# EasyEDA Pro project 偏置放大.eprj

# Schematic Schematic1
Board Name: Board1; Create Date: 2025-06-29; Page Name: P1; Project Name: 偏置放大; Schematic Name: Schematic1; Update Date: 2025-07-05; Page Size: A4; Version: V1.0
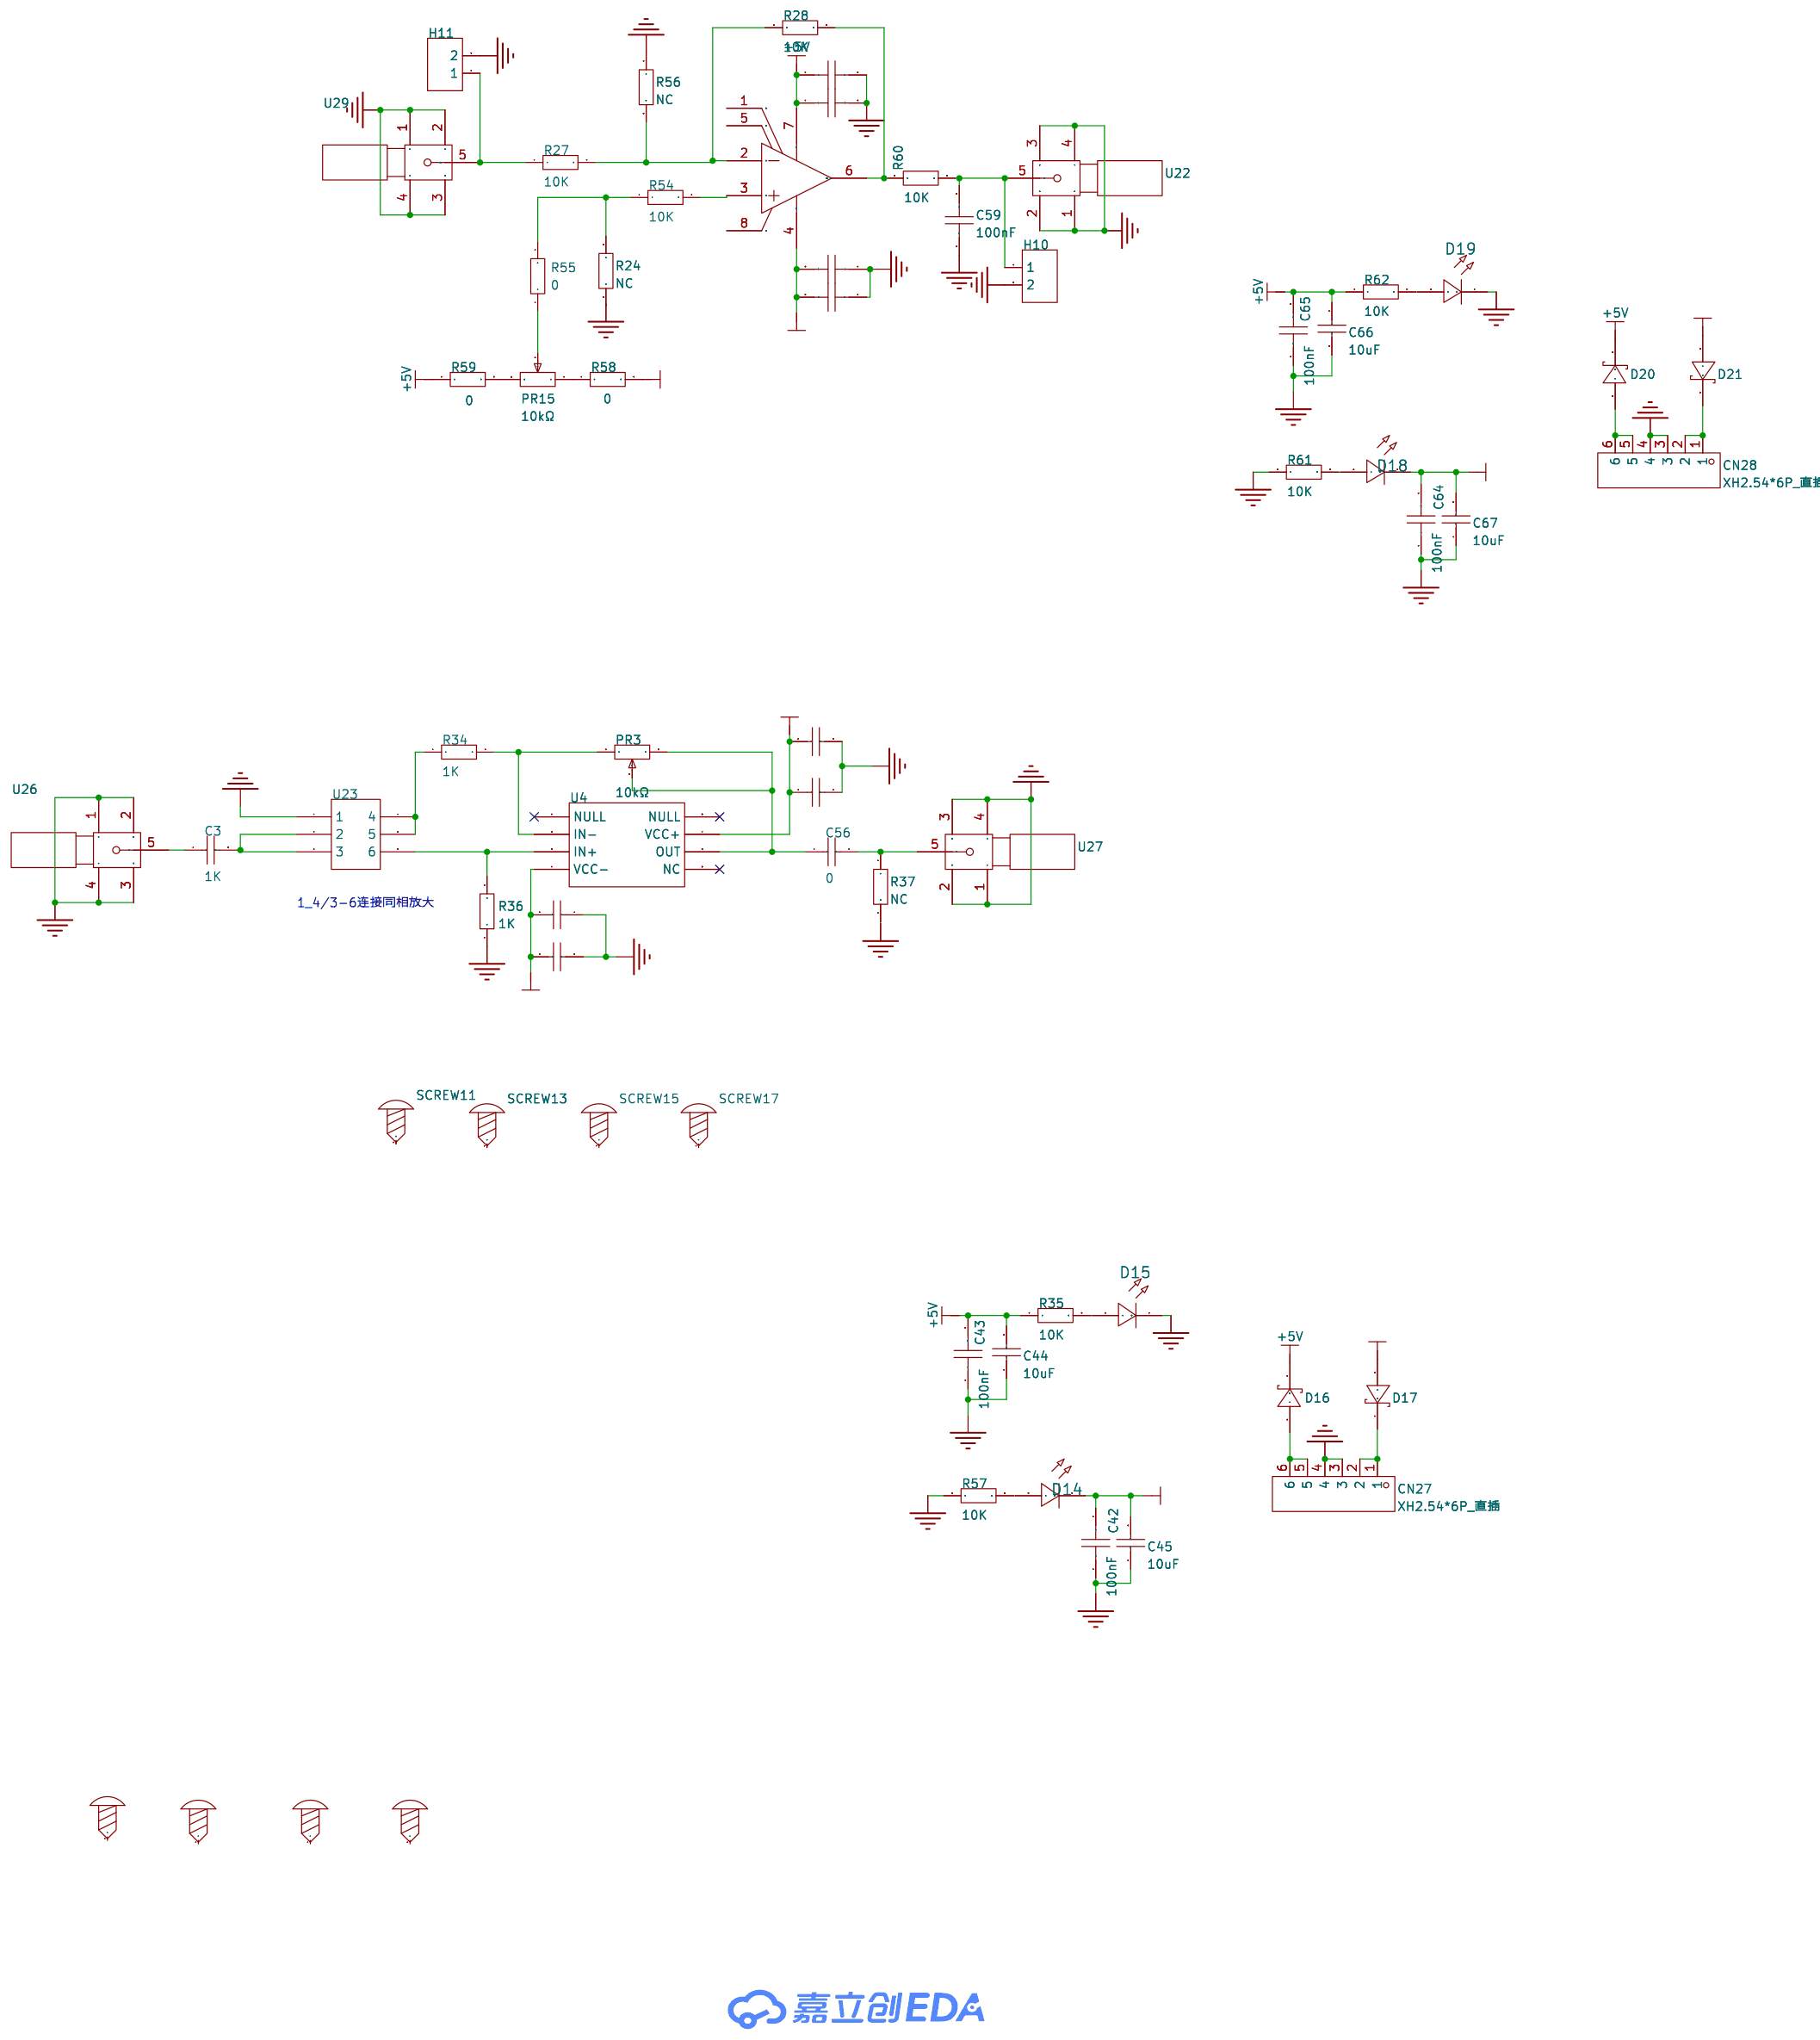
[diagram p0: schematic sheet]

## Parts
C3  1K  [R0805]
C42  100nF  [R0805]
C43  100nF  [R0805]
C44  10uF  [C1210]
C45  10uF  [C1210]
C54  104  [R0805]
C55  104  [R0805]
C56  0  [R0805]
C57  104  [R0805]
C58  104  [R0805]
C59  100nF  [R0805]
C60  100nF  [R0805]
C61  100nF  [R0805]
C62  100nF  [R0805]
C63  100nF  [R0805]
C64  100nF  [R0805]
C65  100nF  [R0805]
C66  10uF  [C1210]
C67  10uF  [C1210]
CN27  XH2.54*6P_直插  [CONN-TH_XH2.54-6P]
CN28  XH2.54*6P_直插  [CONN-TH_XH2.54-6P]
D14  -  [LED_0805]
D15  -  [LED_0805]
D16  SD103AWS  [SOD-323_L1.8-W1.3-LS2.5-RD]
D17  SD103AWS  [SOD-323_L1.8-W1.3-LS2.5-RD]
D18  -  [LED_0805]
D19  -  [LED_0805]
D20  SD103AWS  [SOD-323_L1.8-W1.3-LS2.5-RD]
D21  SD103AWS  [SOD-323_L1.8-W1.3-LS2.5-RD]
H10  -  [HDR-TH_2P-P2.54-V-F]
H11  -  [HDR-TH_2P-P2.54-V-F]
PR3  10kΩ  [R_3296]
PR15  10kΩ  [R_3296]
R24  NC  [R0805]
R27  10K  [R0805]
R28  10K  [R0805]
R34  1K  [R0805]
R35  10K  [R0805]
R36  1K  [R0805]
R37  NC  [R0805]
R54  10K  [R0805]
R55  0  [R0805]
R56  NC  [R0805]
R57  10K  [R0805]
R58  0  [R0805]
R59  0  [R0805]
R60  10K  [R0805]
R61  10K  [R0805]
R62  10K  [R0805]
SCREW11  -  [M3螺丝]
SCREW13  -  [M3螺丝]
SCREW15  -  [M3螺丝]
SCREW17  -  [M3螺丝]
SCREW18  -  [M3螺丝]
SCREW19  -  [M3螺丝]
SCREW20  -  [M3螺丝]
SCREW21  -  [M3螺丝]
U4  -  [THS4001CD]
U22  -  [SMA]
U23  -  [3*3连跳线帽]
U26  -  [SMA]
U27  -  [SMA]
U28  OPA695IDR  [SOIC-8_L5.0-W4.0-P1.27-LS6.1-BL]
U29  -  [SMA]

## Library data of the parts
C3 C54-C58 = CL21C101JBANNNC: 容值:100pF;精度:±5%;额定电压:50V;材质(温度系数):C0G;; LCSC Part Name: 100pF ±5% 50V; Supplier Part: C1790; Manufacturer: SAMSUNG(三星); Supplier Footprint: 0805; JLCPCB Part Class: 基础库; Datasheet: https://atta.szlcsc.com/upload/public/pdf/source/20160218/1457707763339.pdf; Supplier: LCSC; Tolerance: ±5%; Voltage Rated: 50V; Temperature Coefficient: C0G
C42 C43 C59-C65 = CAP_0805: Supplier Footprint: 0805
C44 C45 C66 C67 = CL32B106KAJNNNE: 容值:10uF;精度:±10%;额定电压:25V;材质(温度系数):X7R;; LCSC Part Name: 10uF ±10% 25V; Supplier Part: C39232; Manufacturer: SAMSUNG(三星); Supplier Footprint: 1210; JLCPCB Part Class: 扩展库; Datasheet: https://atta.szlcsc.com/upload/public/pdf/source/20160218/1457707763339.pdf; Supplier: LCSC; Tolerance: ±10%; Voltage Rated: 25V; Temperature Coefficient: X7R
CN27 CN28 = XH2.54*6P_直插: Supplier Part: C9900008614; Supplier Footprint: XH2.54_6P; JLCPCB Part Class: 扩展库; Supplier: LCSC
D14 D15 D18 D19 = LED_0805-R: Supplier Footprint: 0805
D16 D17 D20 D21 = SD103AWS_C181207: 正向压降(Vf):600mV@200mA;直流反向耐压(Vr):40V;整流电流:350mA;; LCSC Part Name: 电压:40V 电流:350mA 丝印S4; Supplier Part: C181207; Manufacturer: Hottech(合科泰); Supplier Footprint: SOD-323; JLCPCB Part Class: 扩展库; Datasheet: https://atta.szlcsc.com/upload/public/pdf/source/20240513/4691873FBB9173EFBCF4C6FD4BBA1025.pdf; Supplier: LCSC; Forward Voltage (Vf@If): 600mV@200mA; Reverse Voltage (Vr): 40V; Rectified Current: 350mA
H10 H11 = HDR-F_2.54_1x2P: Supplier Part: C49661; Supplier Footprint: 插件
PR3 PR15 = R_3296: Supplier Footprint: 直插
R24 R27 R28 R35 R54-R62 = Res_0805: Supplier Footprint: 0805
R34 R36 R37 = 0805W8F510JT5E: 电阻类型:厚膜电阻;阻值:51Ω;精度:±1%;功率:125mW;最大工作电压:150V;温度系数:±100ppm/℃;; LCSC Part Name: 51Ω ±1% 125mW 厚膜电阻; Supplier Part: C17738; Manufacturer: UNI-ROYAL(厚声); Supplier Footprint: 0805; JLCPCB Part Class: 基础库; Datasheet: https://atta.szlcsc.com/upload/public/pdf/source/20200306/C422600_1E6D84923E4A46A82E41ADD87F860B5C.pdf; Supplier: LCSC; Type: 厚膜电阻; Tolerance: ±1%; Power(Watts): 125mW; Overload Voltage (Max): 150V; Temperature Coefficient: ±100ppm/℃; Operating Temperature Range: -55℃~+155℃
SCREW11 SCREW13 SCREW15 SCREW17-SCREW21 = M3螺丝: Supplier Footprint: 插件
U4 = THS4001CD
U22 U26 U27 U29 = SMA
U23 = 3*3连跳线帽
U28 = OPA695IDR: Supplier Part: C1848175; Manufacturer: TI(德州仪器); Supplier Footprint: SOIC-8; JLCPCB Part Class: 扩展库; Datasheet: https://www.ti.com/cn/lit/gpn/opa695; Supplier: LCSC; Number of Channels: 单路; Slew Rate: 4.3V/ns; Ib - Input Bias Current: 20uA; Output Current: 120mA; Operating Temperature: -40℃~+85℃

## Nets
+5V: C43.2 C44.2 C55.2 C58.2 C62.1 C63.1 C65.2 C66.2 D16.1(C) D20.1(C) R35.1 R59.1 R62.1 U4.7(VCC+) U28.7(+VS)
-5V: C42.2 C45.2 C54.2 C57.2 C60.2 C61.2 C64.2 C67.2 D14.1(C) D17.2(A) D18.1(C) D21.2(A) R58.2 U4.4(VCC-) U28.4(-VS)
GND: C42.1 C43.1 C44.1 C45.1 C54.1 C55.1 C57.1 C58.1 C59.1 C60.1 C61.1 C62.2 C63.2 C64.1 C65.1 C66.1 C67.1 CN27.3 CN27.4 CN28.3 CN28.4 D15.1(C) D19.1(C) H10.2 H11.2 R24.1 R36.1 R37.2 R56.1 R57.1 R61.1 U22.1 U22.2 U22.3 U22.4 U23.1 U26.1 U26.2 U26.3 U26.4 U27.1 U27.2 U27.3 U27.4 U29.1 U29.2 U29.3 U29.4
$1N663: PR3.1 R34.2 U4.2(IN-)
$1N664: R36.2 U4.3(IN+) U23.6
$1N666: R34.1 U23.4 U23.5
$1N668: C3.1 U26.5
$1N670: C56.1 PR3.2 PR3.3 U4.6(OUT)
$1N672: C3.2 U23.2 U23.3
$1N676: C56.2 R37.1 U27.5
$1N1584: PR15.2 R55.1
$1N1586: R27.2 R28.1 R56.2 U28.2(-IN)
$1N1588: R24.2 R54.1 R55.2
$1N1589: R54.2 U28.3(+IN)
$1N1595: D15.2(A) R35.2
$1N1601: CN27.5 CN27.6 D16.2(A)
$1N1602: CN27.1 CN27.2 D17.1(C)
$1N1604: D14.2(A) R57.2
$1N1739: R28.2 R60.1 U28.6(Output)
$1N1742: C59.2 H10.1 R60.2 U22.5
$1N2826: H11.1 R27.1 U29.5
$1N3734: CN28.5 CN28.6 D20.2(A)
$1N3736: CN28.1 CN28.2 D21.1(C)
$1N3738: D19.2(A) R62.2
$1N3740: D18.2(A) R61.2
$1N3753: PR15.1 R58.1
$1N3755: PR15.3 R59.2

Not connected (* = marked no-connect by the designer): SCREW11 1; SCREW13 1; SCREW15 1; SCREW17 1; SCREW18 1; SCREW19 1; SCREW20 1; SCREW21 1; U4 1(NULL)* 5(NC)* 8(NULL)*; U28 1(NC) 5(NC) 8(DIS#)

## Notes on the sheet
- 1_4/3-6连接同相放大

# Board PCB1
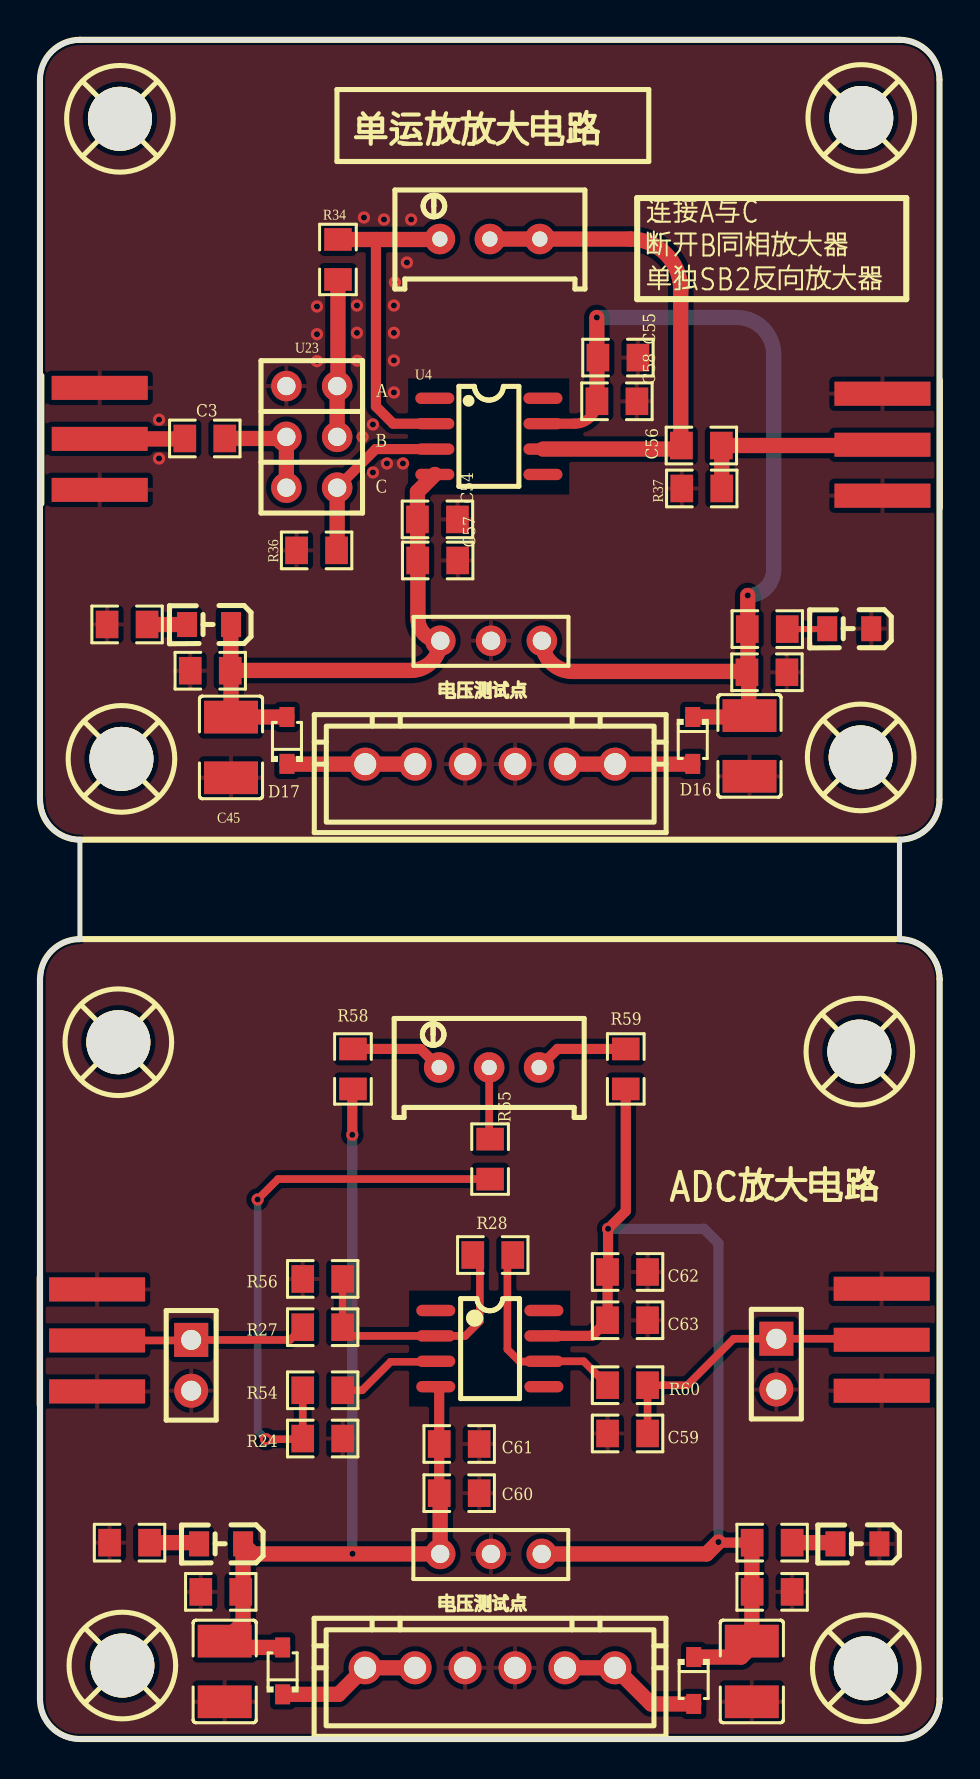
[diagram p1: board, top side]
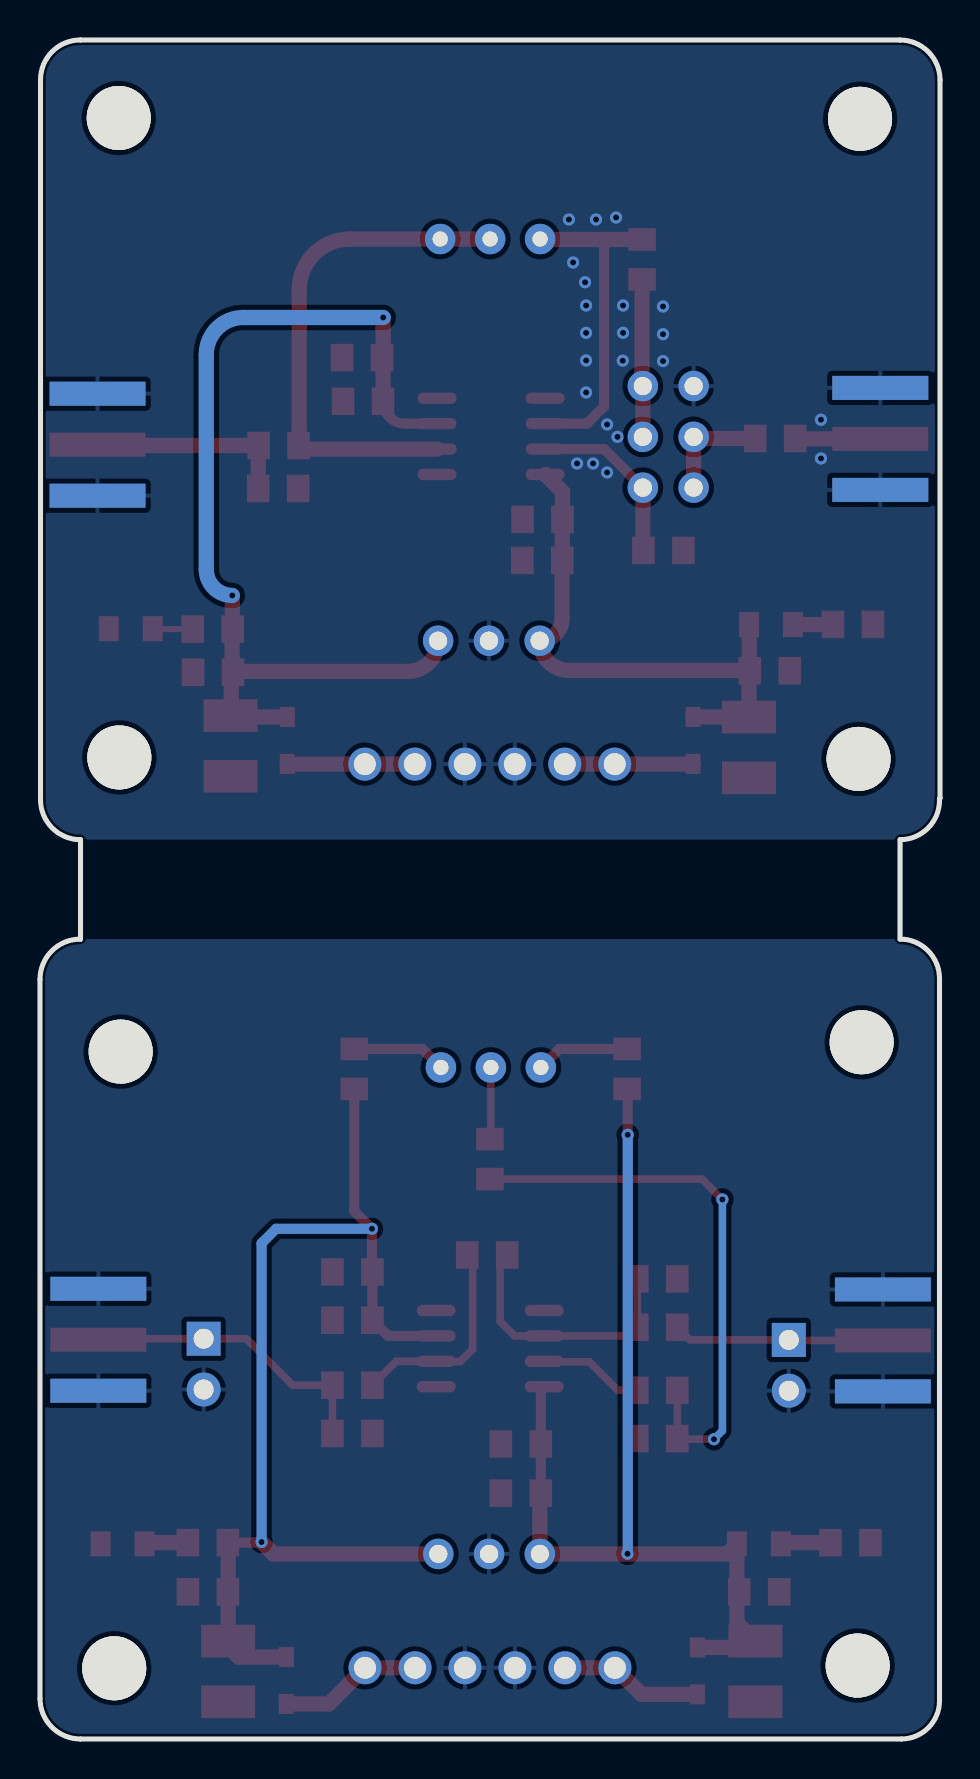
[diagram p2: board, bottom side, seen from below]

Outline 45.03 x 84.96 mm; copper layers: Top Layer, Bottom Layer. Coordinates in mm from the lower left corner of the outline.
Outline path: 0,82.95 arc(0.59,84.37) 2.01,84.96 43.01,84.96 arc(44.42,84.38) 45,82.97 45,46.97 arc(44.41,45.56) 43,44.97 43,40 43.01,40 arc(44.44,39.41) 45.03,37.98 45.03,2.03 arc(44.43,0.59) 43,0 1.94,0 arc(0.59,0.56) 0.03,1.91 0.03,38.03 arc(0.6,39.42) 2,40 2,44.97 arc(0.6,45.55) 0.03,46.94 0.03,47.02 arc(0.01,47.03) 0,47.05 0,82.95
Stack: Top Layer 0.035mm / Dielectric1 1.51mm FR4 er 4.5 / Bottom Layer 0.035mm

## Design rules (mm)
template: 自定义配置
spacing copperThickness1oz (default): track to track 0.102, other pairs 0.152 to 0.3
spacing copperThickness2oz: track to track 0.203, other pairs 0.152 to 0.3
track width copperThickness1oz (default): min 0.127, default 0.381, max 2.54
track width copperThickness2oz: min 0.203, default 0.254, max 2.54
differential pair differentialPair (default): width min 0.127, default 0.254, max 2.54; gap min 0.152, default 0.152
via viaSize (default): diameter min 0.5, default 0.61, max 10; hole min 0.3, default 0.305, max 6.3

## Placement (name value [footprint] x y rotation side)
C3  1K  [R0805#2]  8.36 65.03 0 top
C42  100nF  [R0805#2]  8.63 53.42 0 top
C43  100nF  [R0805#2]  36.26 53.34 180 top
C44  10uF  [C1210]  35.5 49.66 90 top
C45  10uF  [C1210]  9.56 49.58 90 top
C54  104  [R0805#2]  19.77 60.99 180 top
C55  104  [R0805#2]  28.8 69.08 180 top
C56  0  [R0805#2]  33.2 64.68 0 top
C57  104  [R0805#2]  19.79 58.93 180 top
C58  104  [R0805#2]  28.75 66.89 180 top
C59  100nF  [R0805#2]  29.51 15.28 0 top
C60  100nF  [R0805#2]  20.86 12.29 180 top
C61  100nF  [R0805#2]  20.86 14.75 180 top
C62  100nF  [R0805#2]  29.51 23.35 0 top
C63  100nF  [R0805#2]  29.51 20.94 0 top
C64  100nF  [R0805#2]  9.16 7.36 0 top
C65  100nF  [R0805#2]  36.52 7.36 180 top
C66  10uF  [C1210]  35.61 3.38 90 top
C67  10uF  [C1210]  9.24 3.38 90 top
CN27  XH2.54*6P_直插  [CONN-TH_XH2.54-6P]  22.52 48.75 0 top
CN28  XH2.54*6P_直插  [CONN-TH_XH2.54-6P]  22.52 3.56 0 top
D14  -  [LED_0805]  8.41 55.73 180 top
D15  -  [LED_0805]  40.44 55.53 180 top
D16  SD103AWS  [SOD-323_L1.8-W1.3-LS2.5-RD]  32.66 49.93 270 top
D17  SD103AWS  [SOD-323_L1.8-W1.3-LS2.5-RD]  12.36 49.93 90 top
D18  -  [LED_0805]  9.01 9.76 180 top
D19  -  [LED_0805]  40.84 9.76 180 top
D20  SD103AWS  [SOD-323_L1.8-W1.3-LS2.5-RD]  32.7 2.93 270 top
D21  SD103AWS  [SOD-323_L1.8-W1.3-LS2.5-RD]  12.14 3.41 90 top
H10  -  [HDR-TH_2P-P2.54-V-F]  36.84 18.75 270 top
H11  -  [HDR-TH_2P-P2.54-V-F]  7.57 18.69 270 top
NOREF  -  [Pad_e375]  22.56 9.25 180 top
NOREF#2  -  [Pad_e179]  22.57 54.92 180 top
NOREF#3  -  [Pad_e180]  25.11 54.92 180 top
NOREF#4  -  [Pad_e374]  25.1 9.25 180 top
NOREF#5  -  [Pad_e373]  20.02 9.25 180 top
NOREF#6  -  [Pad_e178]  20.03 54.92 180 top
PR3  10kΩ  [R_3296]  22.51 75.13 0 top
PR15  10kΩ  [R_3296]  22.47 33.71 0 top
R24  NC  [R0805]  14.14 15.02 180 top
R27  10K  [R0805]  14.14 20.59 0 top
R28  10K  [R0805]  22.65 24.2 0 top
R34  1K  [R0805]  14.91 73.98 90 top
R35  10K  [R0805]  36.38 55.5 0 top
R36  1K  [R0805]  13.84 59.44 0 top
R37  NC  [R0805]  33.11 62.53 180 top
R54  10K  [R0805]  14.14 17.44 0 top
R55  0  [R0805]  22.52 29 270 top
R56  NC  [R0805]  14.14 23.01 0 top
R57  10K  [R0805]  4.36 55.73 0 top
R58  0  [R0805]  15.66 33.51 270 top
R59  0  [R0805]  29.31 33.51 90 top
R60  10K  [R0805]  29.4 17.69 0 top
R61  10K  [R0805]  4.48 9.82 0 top
R62  10K  [R0805]  36.63 9.82 0 top
SCREW11  -  [M3螺丝]  4 81.02 0 top
SCREW13  -  [M3螺丝]  41.09 81.06 0 top
SCREW15  -  [M3螺丝]  4.08 49.01 0 top
SCREW17  -  [M3螺丝]  41.06 49.08 0 top
SCREW18  -  [M3螺丝]  41.31 3.54 0 top
SCREW19  -  [M3螺丝]  3.92 34.84 0 top
SCREW20  -  [M3螺丝]  4.12 3.67 0 top
SCREW21  -  [M3螺丝]  40.99 34.37 0 top
U4  -  [THS4001CD]  22.56 64.53 0 top
U22  -  [SMA]  45.92 25.83 180 top
U23  -  [3*3连跳线帽]  17.41 72.73 0 top
U26  -  [SMA]  -0.82 59.15 0 top
U27  -  [SMA]  45.96 70.58 180 top
U28  OPA695IDR  [SOIC-8_L5.0-W4.0-P1.27-LS6.1-BL]  22.51 19.52 270 top
U29  -  [SMA]  -0.95 14.07 0 top

## Footprints (pads in the part's own frame, mm; a bottom-side part is the same pattern mirrored in y, then rotated)
3*3连跳线帽
  round 1.524 hole 0.914: 1(-5.08,-5.08) 2(-5.08,-7.62) 3(-5.08,-10.16) 4(-2.54,-5.08) 5(-2.54,-7.62) 6(-2.54,-10.16)
C1210
  rect 1.635x2.7 smd: 1(-1.518,0) 2(1.518,0)
CONN-TH_XH2.54-6P
  round 1.65 hole 1.1: 1(-6.25,0) 2(-3.75,0) 3(-1.25,0) 4(1.25,0) 5(3.75,0) 6(6.25,0)
HDR-TH_2P-P2.54-V-F
  rect 1.7x1.7 hole 1: 1(-1.27,0)
  round 1.7 hole 1: 2(1.27,0)
LED_0805
  rect 1x1.25 smd: 1(-1.15,0.005) 2(1.05,0.005)
M3螺丝
  round 3.2 hole 3.2: 1(0,0)
Pad_e178
  round 1.524 hole 0.914: 3(0,0)
Pad_e179
  round 1.524 hole 0.914: 1(0,0)
Pad_e180
  round 1.524 hole 0.914: 2(0,0)
Pad_e373
  round 1.524 hole 0.914: 3(0,0)
Pad_e374
  round 1.524 hole 0.914: 2(0,0)
Pad_e375
  round 1.524 hole 0.914: 1(0,0)
R0805
  rect 1.133x1.377 smd: 1(-1,0) 2(1,0)
R0805#2
  rect 1.133x1.377 smd: 1(-1.111,0) 2(0.889,0)
R_3296
  round 1.524 hole 0.762: 1(-2.499,-0.127) 2(0,-0.127) 3(2.499,-0.127)
SMA
  rect 4.8x1.2 smd: 1(3.81,8.412) 2(3.81,3.312) 5(3.81,5.862)
  rect 4.8x1.2 smd far side: 3(3.81,3.312) 4(3.81,8.412)
SOD-323_L1.8-W1.3-LS2.5-RD
  rect 1x0.75 smd: 1(-1.173,0) 2(1.173,0)
SOIC-8_L5.0-W4.0-P1.27-LS6.1-BL
  oval 0.569x1.95 smd: 1(-1.905,-2.705) 2(-0.635,-2.705) 3(0.635,-2.705) 4(1.905,-2.705) 5(1.905,2.705) 6(0.635,2.705) 7(-0.635,2.705) 8(-1.905,2.705)
THS4001CD
  oval 1.95x0.569 smd: 1(-2.804,2.51) 2(-2.804,1.24) 3(-2.804,-0.029) 4(-2.804,-1.3) 5(2.606,-1.3) 6(2.606,-0.029) 7(2.606,1.24) 8(2.606,2.51)

## Nets
As in the schematic, except:
+5V: C43.2 C44.2 C55.2 C58.2 C62.1 C63.1 C65.2 C66.2 D16.1 D20.1 NOREF#3.2 NOREF#4.2 R35.1 R59.1 R62.1 U4.7 U28.7
-5V: C42.2 C45.2 C54.2 C57.2 C60.2 C61.2 C64.2 C67.2 D14.1 D17.2 D18.1 D21.2 NOREF#5.3 NOREF#6.3 R58.2 U4.4 U28.4
GND: C42.1 C43.1 C44.1 C45.1 C54.1 C55.1 C57.1 C58.1 C59.1 C60.1 C61.1 C62.2 C63.2 C64.1 C65.1 C66.1 C67.1 CN27.3 CN27.4 CN28.3 CN28.4 D15.1 D19.1 H10.2 H11.2 NOREF.1 NOREF#2.1 R24.1 R36.1 R37.2 R56.1 R57.1 R61.1 U22.1 U22.2 U22.3 U22.4 U23.1 U26.1 U26.2 U26.3 U26.4 U27.1 U27.2 U27.3 U27.4 U29.1 U29.2 U29.3 U29.4

Pads without a net: SCREW11 1; SCREW13 1; SCREW15 1; SCREW17 1; SCREW18 1; SCREW19 1; SCREW20 1; SCREW21 1; U4 1 5 8; U28 1 5 8

## Via types
v1: diameter 0.61, hole 0.305, Top Layer to Bottom Layer, 30 vias

## Routing (per net, layer and track width the routed paths; a pad name or vN(x,y) marks a point on that pad's centre or on a via; arc(x,y) is an arc through that point)
+5V: length 105.4
  Top Layer w0.508: R62.1 33.97,9.82 v1(33.94,9.85) ; R59.1 29.31,26.4 v1(28.42,25.51) 28.42,23.38 C62.1 C63.1 27.61,20.16 U28.7 ; U4.7 26.75,65.77 arc(27.54,66.1) C58.2
  Top Layer w0.762: NOREF#4.2 33.35,9.25 v1(33.94,9.85) ; 35.61,4.63 35.08,4.1 D20.1 ; v1(35.41,57.18) 35.41,55.53 arc(35.42,55.53) 35.42,55.52 35.42,53.38 ; R62.1 35.61,9.8 35.61,4.89 ; v1(27.86,71.08) 27.86,69.14 arc(27.87,69.1) C55.2 arc(27.88,69.06) 27.86,69.03 C58.2 ; 35.42,53.38 26.64,53.38 arc(25.56,53.83) NOREF#3.2 ; 35.42,53.38 arc(35.45,53.37) 35.46,53.35 35.46,51.1 arc(35.46,51.11) 35.45,51.11 D16.1
  Bottom Layer w0.508: v1(28.42,25.51) 33.21,25.51 33.94,24.78 v1(33.94,9.85)
  Bottom Layer w0.762: v1(27.86,71.08) 34.86,71.08 arc(36.17,70.54) 36.71,69.23 36.71,58.48 arc(36.33,57.57) v1(35.41,57.18)
-5V: length 78.2
  Top Layer w0.508: U28.4 19.97,17.45 C61.2 C60.2 ; v1(15.62,30.21) 15.62,32.47 R58.2
  Top Layer w0.762: U4.4 18.89,62.37 C54.2 18.9,60.98 C57.2 arc(18.9,58.93) 18.91,58.92 18.91,56.04 arc(19.24,55.25) NOREF#6.3 arc(19.59,53.87) 18.54,53.43 9.55,53.43 ; 9.55,53.43 9.55,55.72 arc(9.55,55.73) D14.1 ; 9.55,53.43 arc(9.55,53.43) 9.56,53.42 C45.2 arc(9.56,51.11) 9.56,51.11 D17.2 ; C60.2 20.02,12.24 NOREF#5.3 10.66,9.25 D18.1 10.16,5.81 9.24,4.89 9.56,4.58 D21.2
  Bottom Layer w0.508: v1(15.62,30.21) 15.62,9.28 v1(15.64,9.26)
GND:
  vias: v1(5.96,65.97) v1(5.96,64.03) v1(13.86,71.63) v1(13.86,70.25) v1(13.86,68.9) v1(15.86,71.68) v1(15.86,70.32) v1(15.87,68.92) v1(16.14,65.11) v1(16.21,76.08) v1(16.66,65.73) v1(16.66,63.33) v1(17.21,75.98) v1(17.36,63.78) v1(17.76,72.84) v1(17.71,71.68) v1(17.71,70.32) v1(17.71,68.93) v1(17.71,67.33) v1(18.16,63.78) v1(18.36,73.83) v1(18.57,75.98)
$1N663: length 16.8
  Top Layer w0.508: U4.2 17.67,65.77 16.81,66.63 16.81,74.97 16.83,74.98
  Top Layer w0.762: R34.2 19.98,74.98 arc(20,74.99) PR3.1
$1N664: length 8.8
  Top Layer w0.508: U4.3 16.8,64.5 U23.6
  Top Layer w0.762: U23.6 14.87,59.47 arc(14.86,59.45) R36.2
$1N666: length 7.9
  Top Layer w0.762: U23.5 U23.4 arc(14.9,67.67) 14.91,67.69 R34.1
$1N668: length 4.3
  Top Layer w0.762: U26.5 7.23,65.01 arc(7.24,65.02) C3.1
$1N670: length 25.8
  Top Layer w0.762: PR3.2 PR3.3 29.52,75.01 arc(31.31,74.26) 32.06,72.47 32.06,64.71 arc(32.07,64.69) C56.1 arc(32.04,64.56) 31.91,64.5 U4.6
$1N672: length 5.7
  Top Layer w0.762: C3.2 12.25,65.03 arc(12.3,65.06) U23.2 U23.3
$1N676: length 10.2
  Top Layer w0.762: R37.1 34.11,64.66 arc(34.1,64.68) C56.2 42.11,64.68 arc(42.14,64.69) 42.15,64.72
$1N1584: length 3.6
  Top Layer w0.381: PR15.2 22.47,30.05 R55.1
$1N1586: length 13.2
  Top Layer w0.381: R28.1 22.01,23.85 22.01,20.89 21.28,20.16 U28.2 15.58,20.16 R27.2 R56.2
$1N1588: length 28.5
  Top Layer w0.381: R55.2 11.91,28 v1(10.89,26.98) ; v1(11.31,14.99) 13.11,14.99 R24.2 R54.1
  Bottom Layer w0.381: v1(11.31,14.99) 10.89,15.41 v1(10.89,26.98)
$1N1589: length 5.3
  Top Layer w0.381: U28.3 19.78,18.86 17.54,18.86 16.12,17.44 R54.2
$1N1595: length 2
  Top Layer w0.305: D15.2 39.37,55.5 R35.2
$1N1601: length 6.4
  Top Layer w0.762: CN27.5 CN27.6 32.65,48.75 arc(32.65,48.75) D16.2
$1N1602: length 6.4
  Top Layer w0.762: CN27.2 CN27.1 12.37,48.75 arc(12.36,48.75) D17.1
$1N1604: length 2
  Top Layer w0.762: D14.2 5.41,55.73 arc(5.37,55.75) 5.36,55.78
$1N1739: length 10.6
  Top Layer w0.381: R28.2 23.38,23.93 23.38,19.49 24,18.87 25.2,18.87 U28.6 27.2,18.89 R60.1
$1N1742: length 15.1
  Top Layer w0.381: C59.2 R60.2 32.38,17.69 34.71,20.01 42.06,20.01 42.11,19.96
$1N2826: length 10.6
  Top Layer w0.381: 2.86,19.93 7.54,19.93 H11.1 12.51,19.96 R27.1
$1N3734: length 7.2
  Top Layer w0.762: D20.2 30.57,1.75 CN28.6 CN28.5
$1N3736: length 7.2
  Top Layer w0.762: D21.1 14.94,2.23 CN28.1 CN28.2
$1N3738: length 2.2
  Top Layer w0.762: D19.2 39.73,9.82 R62.2
$1N3740: length 2.5
  Top Layer w0.762: D18.2 7.9,9.82 R61.2
$1N3753: length 4.7
  Top Layer w0.508: PR15.1 19.04,34.51 R58.1
$1N3755: length 4.7
  Top Layer w0.508: R59.2 25.9,34.51 24.97,33.58

## Copper pours and planes (outline as drawn; the poured copper is in the pictures)
GND on Top Layer: -15.63,106.39 60.26,106.39 60.26,-19.63 -15.63,-19.63
GND on Bottom Layer: -12.81,106.74 54.62,106.74 54.62,-18.22 -12.81,-18.22

## Text on the board
Top Silkscreen Layer: B | C | A | 电压测试点 | 单运放放大电路 | ADC放大电路 | 连接A与C / 断开B同相放大器 / 单独SB2反向放大器
